# EAGLE design IsoIonV0_1 (EAGLE 6.3)
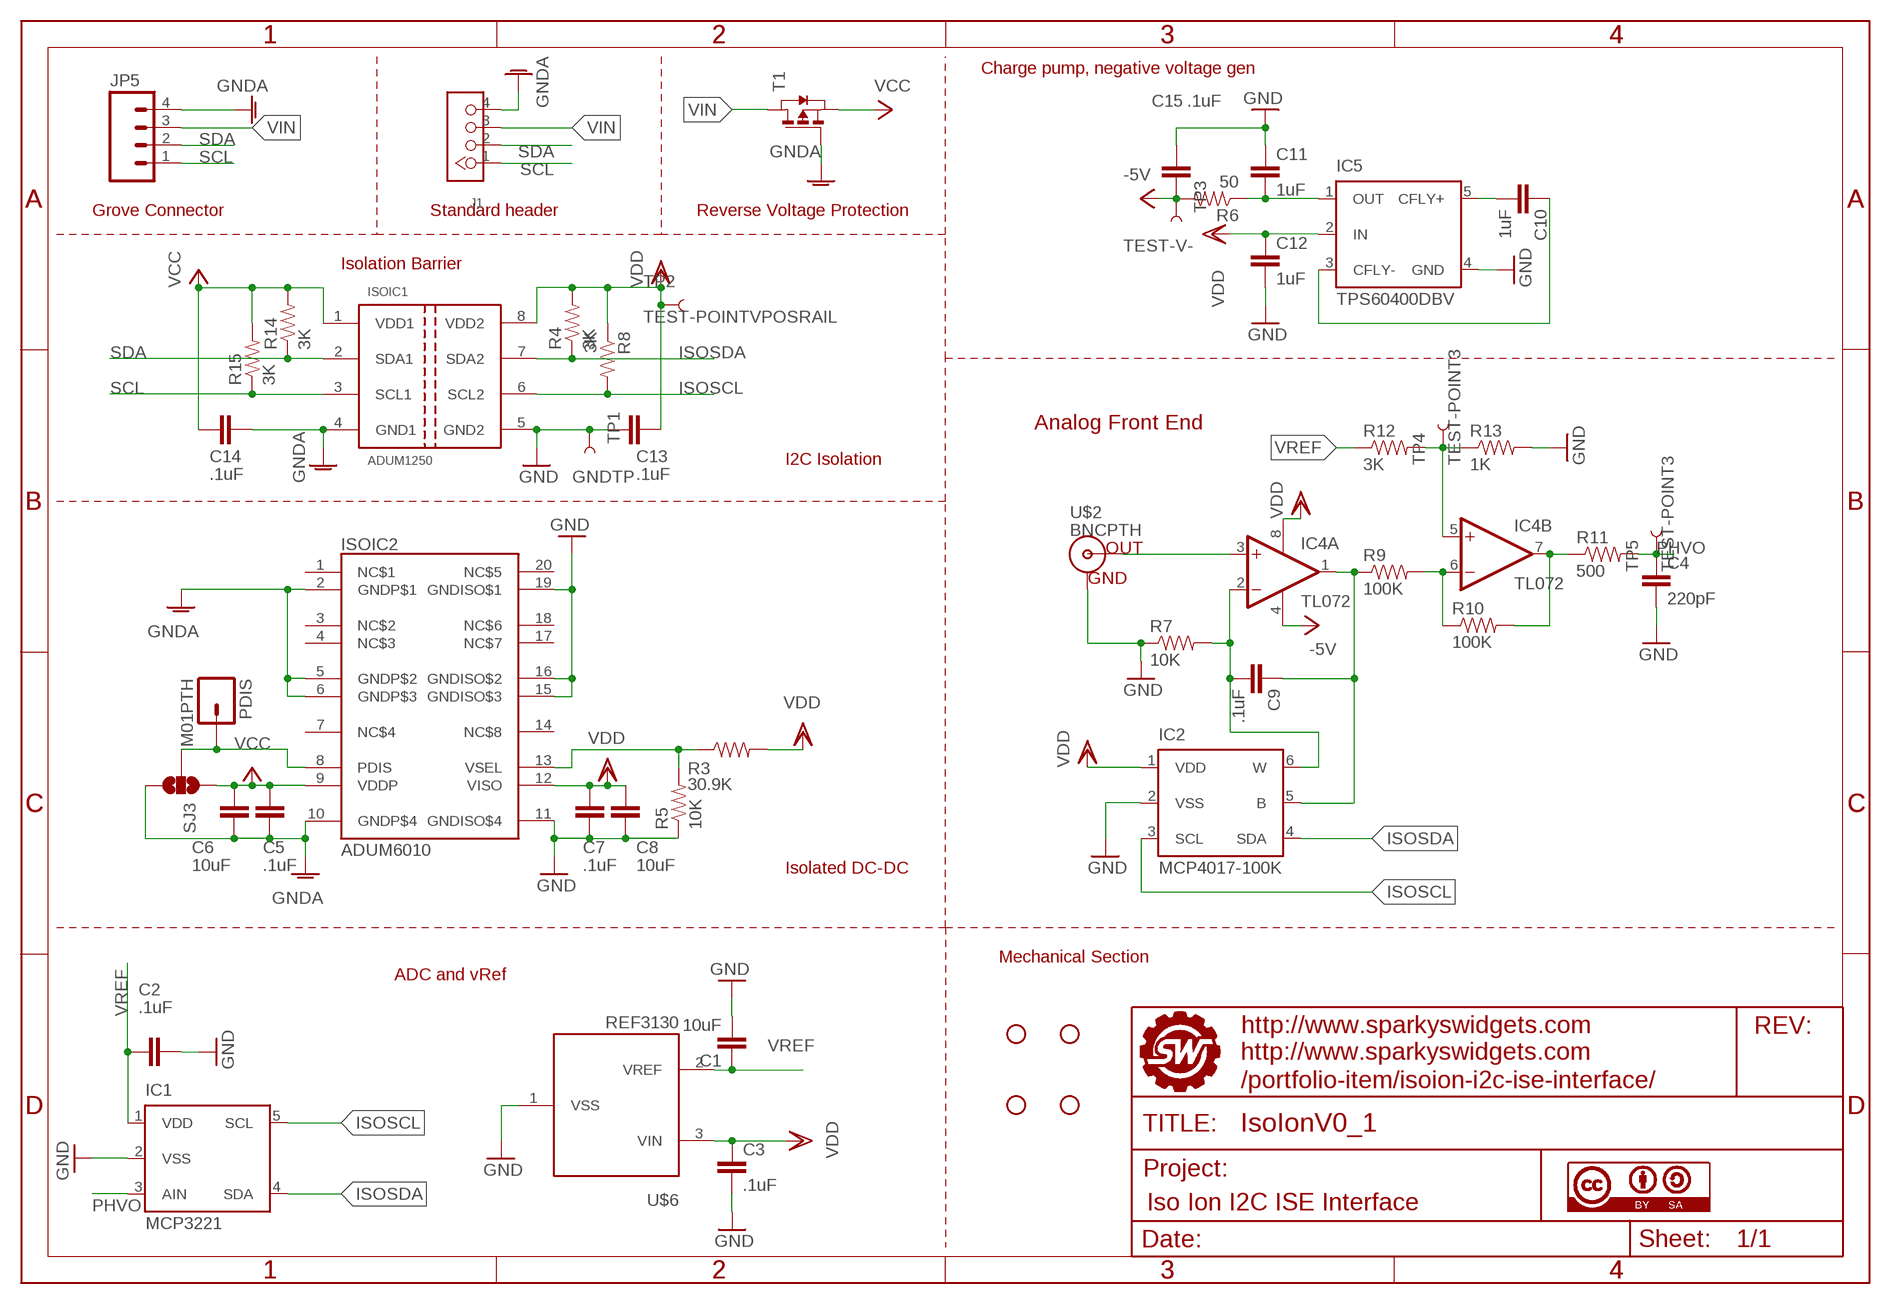
[diagram p0: schematic, sheet 1]

## Parts
C1  10uF  CAP0805  [0805]
C2  .1uF  CAP0805  [0805]
C3  .1uF  CAP0805  [0805]
C4  220pF  CAP0805  [0805]
C5  .1uF  CAP0805  [0805]
C6  10uF  CAP0805  [0805]
C7  .1uF  CAP0805  [0805]
C8  10uF  CAP0805  [0805]
C9  .1uF  CAP0805  [0805]
C10  1uF  CAP0805  [0805]
C11  1uF  CAP0805  [0805]
C12  1uF  CAP0805  [0805]
C13  .1uF  CAP0805  [0805]
C14  .1uF  CAP0805  [0805]
C15  .1uF  CAP0805  [0805]
IC1  MCP3221  [SOT23-DBV]
IC2  MCP4017-100K  MCP4017  [SC70]
IC4  TL072  LM358D  [SO08@1]
IC5  TPS60400DBV  [SOT23-DBV]
ISOIC1  ADUM1250  [SO08]
ISOIC2  ADUM6010  [SSOP20]
J1  TWIG-4P-2.0-2.0  [4P-2.0]
JP1  STAND-OFF  [STAND-OFF]
JP2  STAND-OFF  [STAND-OFF]
JP3  STAND-OFF  [STAND-OFF]
JP4  STAND-OFF  [STAND-OFF]
JP5  M04PTH  [1X04]
PDIS  M01PTH  [1X01]
R3  30.9K  RESISTOR0805-RES  [0805]
R4  3K  RESISTOR0805-RES  [0805]
R5  10K  RESISTOR0805-RES  [0805]
R6  50  RESISTOR0805-RES  [0805]
R7  10K  RESISTOR0805-RES  [0805]
R8  3K  RESISTOR0805-RES  [0805]
R9  100K  RESISTOR0805-RES  [0805]
R10  100K  RESISTOR0805-RES  [0805]
R11  500  RESISTOR0805-RES  [0805]
R12  3K  RESISTOR0805-RES  [0805]
R13  1K  RESISTOR0805-RES  [0805]
R14  3K  RESISTOR0805-RES  [0805]
R15  3K  RESISTOR0805-RES  [0805]
SJ3  SOLDERJUMPER_2WAYPASTE2&3  [SJ_3_PASTE2&3]
T1  PMOSSOT23  [SOT-23]
TP1  GNDTP  TEST-POINTGND  [TEST_GND]
TP2  TEST-POINTVPOSRAIL  [TEST_V+]
TP3  TEST-V-  TEST-POINTNEGRAIL  [TEST_V-]
TP4  TEST-POINT3  [PAD.03X.03]
TP5  TEST-POINT3  [PAD.03X.03]
U$1  FRAME_ISOION  [SWPCBLOGOWITHINFO]
U$2  BNCPTH  [BNC]
U$3  CC-BY-SA  [CC-BY-SA]
U$6  REF3130  MCP1541  [SOT-23]

## Nets
-5V: C15.2 IC4.4(P:V-) R6.2 TP3.P$1
GND: C1.2 C2.1 C3.2 C4.2 C7.2 C8.2 C11.1 C12.2 C13.1 C15.1 IC1.2(VSS) IC2.2(VSS) IC5.4(GND) ISOIC1.5(GND2) ISOIC2.11(GNDISO$4) ISOIC2.15(GNDISO$3) ISOIC2.16(GNDISO$2) ISOIC2.19(GNDISO$1) R5.1 R7.1 R13.2 TP1.P$1 U$2.GND U$6.1(VSS)
GNDA: C5.2 C6.2 C14.1 ISOIC1.4(GND1) ISOIC2.2(GNDP$1) ISOIC2.5(GNDP$2) ISOIC2.6(GNDP$3) ISOIC2.10(GNDP$4) J1.4 JP5.4 SJ3.3 T1.3(G)
ISOSCL: IC1.5(SCL) IC2.3(SCL) ISOIC1.6(SCL2) R8.2
ISOSDA: IC1.4(SDA) IC2.4(SDA) ISOIC1.7(SDA2) R4.1
N$1: IC4.5(B:+IN) R12.2 R13.1 TP4.P$1
N$2: IC4.7(B:OUT) R10.2 R11.1
N$3: IC4.6(B:-IN) R9.2 R10.1
N$4: ISOIC2.8(PDIS) PDIS.1 SJ3.2
N$5: ISOIC2.13(VSEL) R3.1 R5.2
N$6: C11.2 IC5.1(OUT) R6.1
N$7: IC4.3(A:+IN) U$2.S(OUT)
N$9: C9.2 IC2.6(W) IC4.2(A:-IN) R7.2
N$10: C9.1 IC2.5(B) IC4.1(A:OUT) R9.1
N$22: C10.1 IC5.3(CFLY-)
N$23: C10.2 IC5.5(CFLY+)
PHVO: C4.1 IC1.3(AIN) R11.2 TP5.P$1
SCL: ISOIC1.3(SCL1) J1.1 JP5.1 R15.1
SDA: ISOIC1.2(SDA1) J1.2 JP5.2 R14.1
VCC: C5.1 C6.1 C14.2 ISOIC1.1(VDD1) ISOIC2.9(VDDP) R14.2 R15.2 SJ3.1 T1.2(S)
VDD: C3.1 C7.1 C8.1 C12.1 C13.2 IC2.1(VDD) IC4.8(P:V+) IC5.2(IN) ISOIC1.8(VDD2) ISOIC2.12(VISO) R3.2 R4.2 R8.1 TP2.P$1 U$6.3(VIN)
VIN: J1.3 JP5.3 T1.1(D)
VREF: C1.1 C2.2 IC1.1(VDD) R12.1 U$6.2(VREF)
Unconnected: ISOIC2.1(NC$1) ISOIC2.3(NC$2) ISOIC2.4(NC$3) ISOIC2.7(NC$4) ISOIC2.14(NC$8) ISOIC2.17(NC$7) ISOIC2.18(NC$6) ISOIC2.20(NC$5)

## Notes on the sheet
- Charge pump, negative voltage gen
- Grove Connector | Standard header | Reverse Voltage Protection
- Isolation Barrier
- Analog Front End
- I2C Isolation
- Isolated DC-DC
- Mechanical Section
- ADC and vRef

## Library data of the parts
C1-C15 = SparkysWidgets:CAP: Capacitor Standard 0603 ceramic capacitor, and 0.1" leaded capacitor.
IC1 = SparkysWidgets:MCP3221: 12 bit I2C ADC Low power 12-bit I2c ADC from MicroChip upto 22.3KSPS Source: http://ww1.microchip.com/downloads/en/DeviceDoc/21732b.pdf
IC2 = SW_DigitalAnalogICs:MCP4017: I2C digipot 128tap digital potentiometer in 5K, 10K, 50K and 100K variants.
IC4 = SparkysWidgets:LM358: OP AMP also LM158; LM258; LM2904 Source: http://cache.national.com/ds/LM/LM158.pdf
IC5 = SparkysWidgets:TPS60400DBV: UNREGULATED CHARGE PUMP VOLTAGE INVERTER 60-mA unregultated charge pump voltage inverter Source: http://focus.ti.com/lit/ds/symlink/tps6040i.pdf
ISOIC1 = SparkysWidgets:ADUM1250: ADUM1250 Bi-Directional I2C Isolation IC AD iCoupler based tech, I2C Isolation IC, allows for Galavanically Isolated howswapable I2C devices
ISOIC2 = SparkysWidgets:ADUM6010: ADUM6010 ISO DC-DC power uModule AD iCoupler based tech, dc-dc converter. Useful for galvanically isolating supplies accepts wide inpute range and outputs regulated 3v-5.v5@150mA
J1 = Connector:TWIG-4P-2.0
JP1-JP4 = SparkFun:STAND-OFF: Stand Off This is the mechanical footprint for a #4 phillips button head screw. Use the keepout ring to avoid running the screw head into surrounding components. SKU : PRT-00447
JP5 = SparkFun:M04: Header 4 Standard 4-pin 0.1" header. Use with straight break away headers (SKU : PRT-00116), right angle break away headers (PRT-00553), swiss pins (PRT-00743), machine pins (PRT-00117), and female headers (PRT-00115). Molex polarized connector foot print use with SKU : PRT-08231 with associated crimp pins and housings. 1MM SMD Version SKU: PRT-10208
PDIS = SparkFun:M01: Header 1 Standard 1-pin 0.1" header. Use with straight break away headers (SKU : PRT-00116), right angle break away headers (PRT-00553), swiss pins (PRT-00743), machine pins (PRT-00117), and female headers (PRT-00115).
R3-R15 = SparkysWidgets:RESISTOR: Resistor Basic schematic elements and footprints for 0603, 1206, and PTH resistors.
SJ3 = SparkFun:SOLDERJUMPER_2WAY: Solder Jumper 2 way solder jumper
T1 = SparkysWidgets:PMOSSOT23: MOS FET
TP1-TP5 = SW_Passives:TEST-POINT: Bare copper test points for troubleshooting or ICT
U$1 = SW_ArtWork:FRAME_ISOION: A4 Sparky's Widgets frame This is a standard A4 Frame, the Doc Field has been modified with our Logo and contains the license and extra project information!; PROJECT: Iso Ion I2C ISE Interface; URL1: /portfolio-item/isoion-i2c-ise-interface/; URLHOME: http://www.sparkyswidgets.com; URLPROJECT: http://www.sparkyswidgets.com
U$2 = SparkysWidgets:BNC: BNC Connector, Mouser Part# 5227161
U$3 = SW_ArtWork:CC-BY-SA
U$6 = SparkysWidgets:MCP1541

## Board
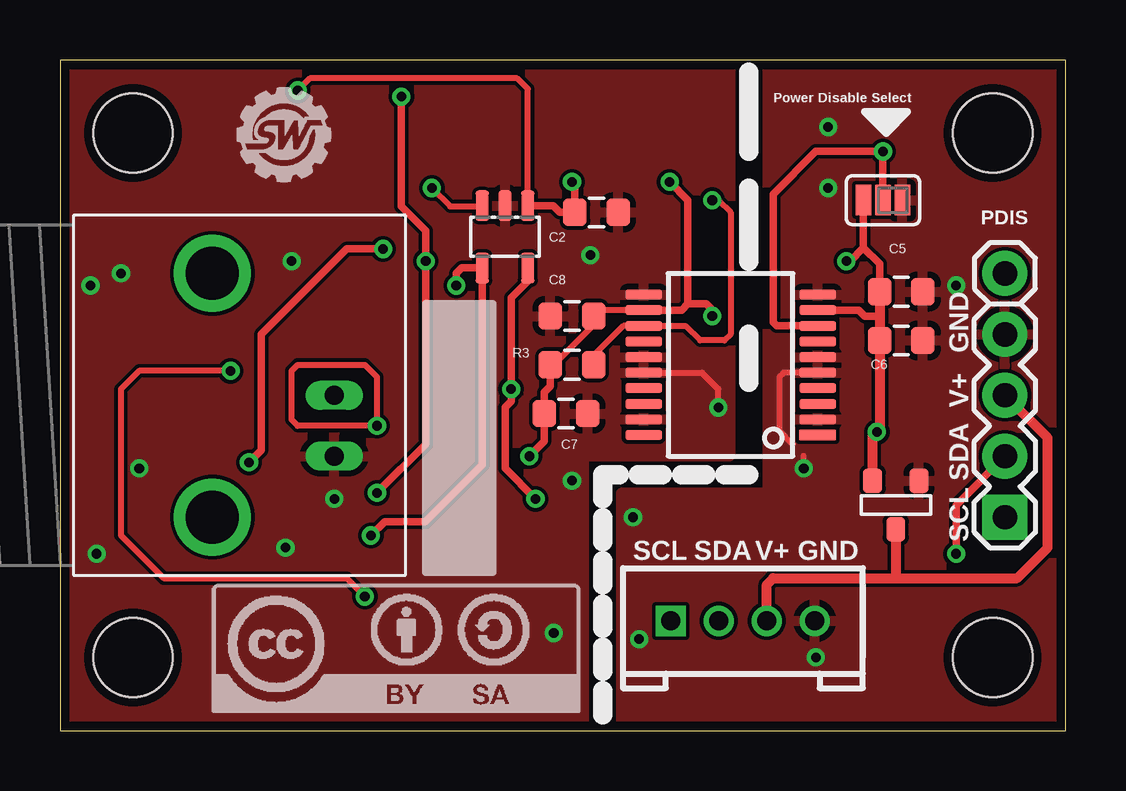
[diagram p1: board, top side]
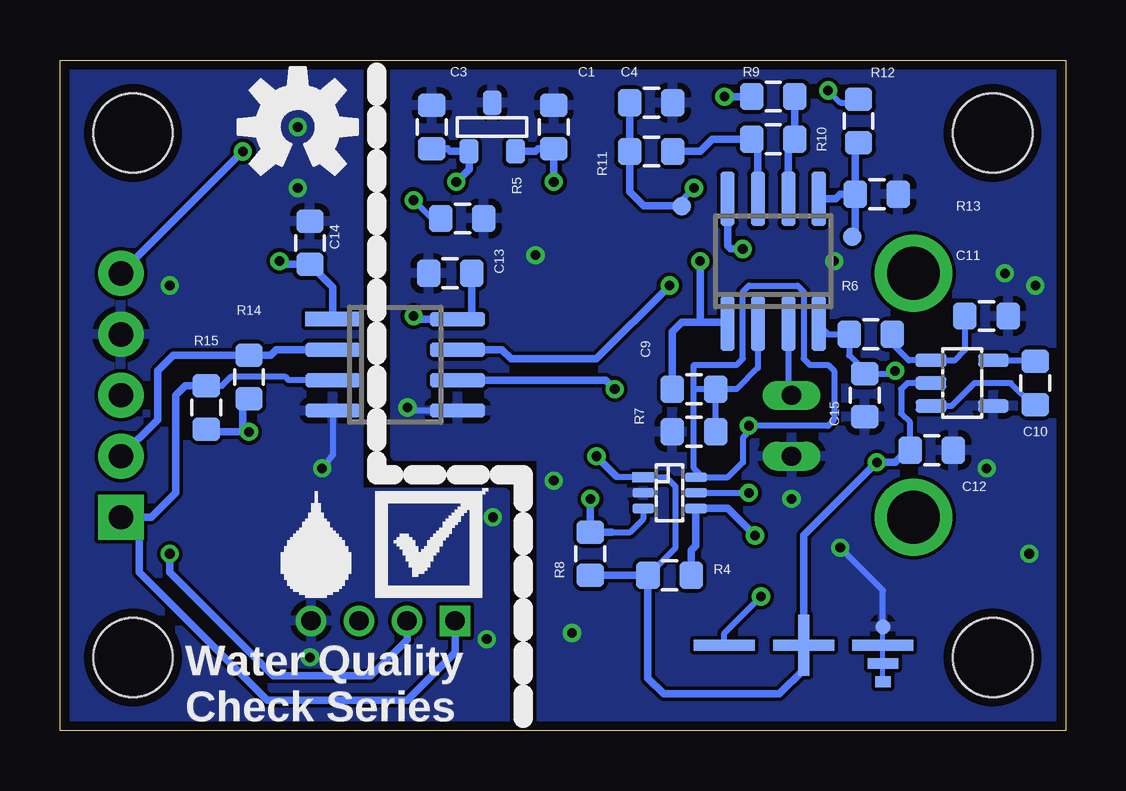
[diagram p2: board, bottom side, seen from below]

Size 41.91 x 27.94 mm. Coordinates in mm from the lower left corner, seen from the top.
Outline: 0,0 41.91,0 41.91,27.94 0,27.94 0,0
Copper layers (1*16): Top 0.0356mm / dielectric 1.5011mm / Bottom 0.0356mm
Design rules "LaenPCBOrder": minimum track width 6mil, minimum drill 13mil, track to track 6mil, track to pad 6mil, pad to pad 6mil, via to via 6mil, smd to smd 6mil, copper to edge 15mil, drill to drill 6mil, minimum pad ring 7mil, minimum via ring 7mil, stop-mask expansion 4mil, vias tented up to drill 0mil, thermal gap 10mil

### Footprints (pad centres in the part's own frame; a part is rotated, then mirrored left to right if it is on the bottom)
0805 = smd 0.984 x 1.143: 1 -0.9,0; 2 0.9,0
SOT23-DBV = smd 0.55 x 1.27: 1 -0.95,-1.3; 2 0,-1.3; 3 0.95,-1.3; 4 0.95,1.3; 5 -0.95,1.3
SC70 = smd 0.4 x 0.9: 1 -0.65,-1.1; 2 0,-1.1; 3 0.65,-1.1; 4 0.65,1.1; 5 0,1.1; 6 -0.65,1.1
SO08@1 = smd 0.6 x 2.286: 1 -1.905,-2.6; 2 -0.635,-2.6; 3 0.635,-2.6; 4 1.905,-2.6; 5 1.905,2.6; 6 0.635,2.6; 7 -0.635,2.6; 8 -1.905,2.6
SO08 = smd 0.6 x 2.286: 1 -1.905,-2.6; 2 -0.635,-2.6; 3 0.635,-2.6; 4 1.905,-2.6; 5 1.905,2.6; 6 0.635,2.6; 7 -0.635,2.6; 8 -1.905,2.6
SSOP20 = smd 0.419 x 1.524: 1 -2.925,-3.625; 2 -2.275,-3.625; 3 -1.625,-3.625; 4 -0.975,-3.625; 5 -0.325,-3.625; 6 0.325,-3.625; 7 0.975,-3.625; 8 1.625,-3.625; 9 2.275,-3.625; 10 2.925,-3.625; 11 2.925,3.625; 12 2.275,3.625; 13 1.625,3.625; 14 0.975,3.625; 15 0.325,3.625; 16 -0.325,3.625; 17 -0.975,3.625; 18 -1.625,3.625; 19 -2.275,3.625; 20 -2.925,3.625
4P-2.0 = drill 0.8 pad 1.27 square: 1 -3,0 | drill 0.8 pad 1.27: 2 -1,0; 3 1,0; 4 3,0
STAND-OFF = hole 3.302: 0,0
1X04 = drill 1.016 pad 1.88 square: 1 0,0 | drill 1.016 pad 1.88: 2 2.54,0; 3 5.08,0; 4 7.62,0
1X01 = drill 1.016 pad 1.88: 1 0,0
SJ_3_PASTE2&3 = smd 0.635 x 1.27: 1 -0.813,0; 2 0,0; 3 0.813,0
SOT-23 = smd 0.787 x 1.016: 1 0.025,-1.016; 2 -0.94,1.016; 3 0.991,1.016
TEST_GND = smd 0.635 x 0.635: P$1 0,0.762 | smd 2.54 x 0.457: P$2 0,0 | smd 1.27 x 0.457: P$3 0,-0.762 | smd 0.635 x 0.457: P$4 0,-1.524
TEST_V+ = smd 0.457 x 1.27: P$1 0,0.635; P$2 0,-0.635 | smd 2.54 x 0.457: P$3 0,0
TEST_V- = smd 2.54 x 0.457: P$1 0,0
PAD.03X.03 = smd 0.762 x 0.762: P$1 0,0
BNC = drill 2.2: 3 -5.08,5.08; 4 5.08,5.08 | drill 0.8 long: GND -2.54,0; S 0,0

### Placement (x,y rotation side)
C1  21.34,25.15 90 bottom
C2  22.35,21.59 180 top
C3  26.42,25.15 90 bottom
C4  17.27,26.16 0 bottom
C5  35.05,18.29 0 top
C6  35.05,16.26 0 top
C7  21.08,13.21 0 top
C8  21.34,17.27 180 top
C9  15.49,14.22 0 bottom
C10  1.27,14.48 90 bottom
C11  3.3,17.27 180 bottom
C12  5.59,11.68 0 bottom
C13  25.65,19.05 0 bottom
C14  31.5,20.32 270 bottom
C15  8.38,13.97 90 bottom
IC1  18.54,20.57 180 top
IC2  16.51,9.91 270 bottom
IC4  12.19,19.56 0 bottom
IC5  4.32,14.48 270 bottom
ISOIC1  27.94,15.24 270 bottom
ISOIC2  27.94,15.24 90 top
J1  28.45,4.57 0 top
JP1  38.86,3.05 0 top
JP2  3.05,3.05 0 top
JP3  38.86,24.89 0 top
JP4  3.05,24.89 0 top
JP5  39.37,8.89 90 top
PDIS  39.37,19.05 0 top
R3  21.34,15.24 180 top
R4  16.51,6.48 180 bottom
R5  25.15,21.34 180 bottom
R6  8.13,16.51 180 bottom
R7  15.49,12.45 0 bottom
R8  19.81,7.37 90 bottom
R9  12.19,26.42 0 bottom
R10  12.19,24.64 180 bottom
R11  17.27,24.13 180 bottom
R12  8.64,25.4 270 bottom
R13  7.87,22.35 0 bottom
R14  34.04,14.73 270 bottom
R15  35.81,13.46 270 bottom
SJ3  34.29,22.1 0 top
T1  34.8,9.4 0 top
TP1  7.62,3.56 0 bottom
TP2  10.92,3.56 0 bottom
TP3  14.22,3.56 0 bottom
TP4  8.89,20.57 0 bottom
TP5  16,21.84 0 bottom
U$1  7.37,22.86 0 top
U$2  11.43,13.97 90 top
U$3  6.35,0.76 0 top
U$4  [OSHW-LOGO-M]  32,25.15 0 bottom
U$6  23.88,25.15 180 bottom
U$7  [SILK_ARROW]  34.29,25.15 0 top
U$8  [WATERCHECKLOGO2]  29.21,7.62 0 bottom
U$9  [WATERCHECKLOGO3]  30.99,2.54 0 bottom

### Tracks (layer width: path | path; a pad name or v marks a point on that pad's centre or on a via)
-5V  (via drill 0.4)
  Top 0.254: v7.11,14.99 3.3,14.99 2.54,14.22 2.54,8.13 4.32,6.35 11.94,6.35 v12.7,5.59
  Bottom 0.254: IC4.4 10.29,16.89 9.91,16.51 R6.2 9.03,15.63 8.27,14.87 C15.2 7.23,14.87 v7.11,14.99 | v12.7,5.59 14.22,4.06 TP3.P$1
GND  (via drill 0.4)
  Top 0.254: v27.43,13.46 27.43,14.22 26.74,14.91 ISOIC2.16
  Bottom 0.254: ISOIC1.5 27.3,13.34 v27.43,13.46 | TP1.P$1 7.62,5.84 v9.4,7.62
  other vias: 22.1,19.81 20.57,4.06 2.54,19.05 21.34,10.41 1.27,18.54 3.3,10.92 11.43,9.65 9.65,19.56 1.52,7.37
  pour Bottom: 21.84,-0.51 21.84,11.43 27.94,11.43 27.94,28.45 -0.51,28.45 -0.51,-0.51
  pour Top: -0.51,28.45 -0.51,-0.51 21.84,-0.51 21.84,11.43 27.94,11.43 27.94,28.45
GNDA  (via drill 0.4)
  Top 0.254: v30.99,10.92 30.99,11.43 | 31.5,12.9 ISOIC2.2 | ISOIC2.5 30.16,14.91 29.97,14.73 29.97,12.51 30.54,11.94
  Bottom 0.254: ISOIC1.4 30.54,11.49 v30.99,10.92
  other vias: 32,22.61 32,25.15 23.88,8.89 37.34,18.54 24.13,3.81 31.5,3.05
  pour Top: 23.37,-0.51 42.42,-0.51 42.42,28.45 29.46,28.45 29.46,9.91 23.37,9.91
  pour Bottom: 23.37,-0.51 23.37,9.91 29.46,9.91 29.46,28.45 42.42,28.45 42.42,-0.51
ISOSCL  (via drill 0.4)
  Top 0.305: IC1.5 19.49,18.73 18.8,18.03 v18.8,14.22 18.8,13.72 18.54,13.46 18.54,10.92 v19.81,9.65
  Bottom 0.254: IC2.3 17.61,8.81 18.15,8.27 18.91,8.27
  Bottom 0.305: 18.91,8.27 R8.2 v19.81,9.65 | ISOIC1.6 19.18,14.61 v18.8,14.22
ISOSDA  (via drill 0.4)
  Top 0.305: v12.95,8.13 13.53,8.7 15.21,8.7 17.59,11.08 IC1.4 16.73,19.27 16.51,19.05 v16.51,18.54
  Bottom 0.305: R4.1 15.61,7.5 15.41,7.7 IC2.4 14.08,9.26 v12.95,8.13 | ISOIC1.7 23.5,15.88 23.11,15.49 19.56,15.49 v16.51,18.54
N$1
  Bottom 0.305: R13.1 8.77,24.36 R12.2 | IC4.5 9.59,22.16 9.4,22.35 R13.1 | R13.1 8.77,20.69 TP4.P$1
N$2
  Bottom 0.305: IC4.7 12.83,24.37 R10.2 14.73,24.64 15.24,24.13 R11.1
N$3
  Bottom 0.305: IC4.6 11.56,24.37 R10.1 R9.2
N$4  (via drill 0.4)
  Top 0.305: SJ3.2 v34.29,24.13 31.5,24.13 29.72,22.35 29.72,17.02 29.87,16.86 ISOIC2.8
  Bottom 0.305: PDIS.1 v34.29,24.13
N$5  (via drill 0.4)
  Top 0.254: v27.18,22.1 27.43,22.1 27.94,21.59 27.94,16.51 27.69,16.26 26.67,16.26 26.06,16.86 ISOIC2.13 23.47,16.86 22.24,15.63 R3.1
  Bottom 0.254: 26.3,21.22 v27.18,22.1
  Bottom 0.305: R5.2 26.3,21.22
N$6
  Bottom 0.254: C11.2 4.2,15.86 4.64,15.43 IC5.1 6.54,15.43 7.23,16.12 R6.1
N$7
  Bottom 0.254: IC4.3 11.56,14.1 U$2.S
N$9  (via drill 0.4)
  Top 0.254: v13.21,12.7 9.91,12.7 9.65,12.95 9.65,14.99 9.91,15.24 12.7,15.24 13.21,14.73 v13.21,12.7
  Bottom 0.254: IC4.2 12.83,15.11 13.72,14.22 C9.2 | C9.2 15.49,14.22 | 15.49,14.22 15.49,15.24 13.72,15.24 13.46,15.49 13.46,18.29 13.21,18.54 11.18,18.54 10.92,18.29 10.92,15.49 10.67,15.24 9.91,15.24 9.65,14.99 9.65,12.95 9.91,12.7 12.95,12.7 13.08,12.57 | 13.08,12.57 13.46,12.19 13.46,11.18 14.08,10.56 IC2.6 15.21,10.64 15.49,10.92 15.49,14.22 | 14.59,12.08 R7.2 C9.2 | v13.21,12.7 13.08,12.57
N$10  (via drill 0.4)
  Top 0.305: v14.22,26.42 14.22,21.84 15.24,20.83 v15.24,19.56 15.24,11.94 v13.21,9.91
  Bottom 0.254: IC2.5 v13.21,9.91
  Bottom 0.305: R9.1 v14.22,26.42 | C9.1 16.39,16.63 16,17.02 15.24,17.02 | 15.24,17.02 v15.24,19.56 | 15.24,17.02 14.16,17.02 IC4.1
N$22
  Bottom 0.254: C10.1 1.39,13.58 2.29,14.48 3.81,14.48 4.76,13.53 IC5.3
N$23
  Bottom 0.254: IC5.5 1.27,15.43 C10.2
PHVO  (via drill 0.4)
  Top 0.254: v15.49,22.61 16.26,21.84 17.56,21.84 IC1.3
  Bottom 0.254: 16.03,21.87 16.03,22.07 v15.49,22.61
  Bottom 0.305: C4.1 R11.2 18.17,22.45 IC1.3 16.03,21.87 TP5.P$1
SCL
  Bottom 0.254: ISOIC1.3 32.38,14.61 32.51,14.73 34.8,14.73 35.17,14.36 R15.1
  Bottom 0.305: JP5.1 38.61,8.89 | 38.61,8.89 38.1,8.89 37.08,9.91 37.08,13.97 36.69,14.36 R15.1 | J1.1 25.45,3.25 27.43,1.27 33.27,1.27 38.61,6.6 38.61,8.89
SDA  (via drill 0.4)
  Top 0.305: v37.34,7.37 37.34,9.4 JP5.2
  Bottom 0.305: JP5.2 37.85,12.95 37.85,14.99 37.2,15.63 R14.1 33.14,15.63 32.89,15.88 ISOIC1.2 | J1.2 27.45,3.79 28.96,2.29 33.02,2.29 37.34,6.6 v37.34,7.37
VCC  (via drill 0.4)
  Top 0.305: ISOIC2.9 33.28,17.52 33.53,17.27 34.15,17.27 | SJ3.1 33.48,20.12 | 33.48,20.12 34.15,19.44 C5.1 | v32.77,19.56 32.92,19.56 33.48,20.12
  Top 0.406: C5.1 34.15,17.27 C6.1 34.15,12.33 v34.04,12.45 33.86,12.27 T1.2
  Bottom 0.305: v32.77,19.56 32.63,19.42 C14.2 30.54,18.46 ISOIC1.1 | v34.04,12.45 34.29,12.45 | 34.29,12.45 35.7,12.45 R15.2 | 34.29,12.45 34.29,13.58 R14.2
VDD  (via drill 0.4)
  Top 0.254: ISOIC2.12 22.48,17.52 C8.1 22.1,17.13 22.1,16.76 20.57,15.24 R3.2
  Top 0.305: v7.87,11.18 8.38,11.68 8.38,16.51 11.94,20.07 v13.46,20.07 | v25.4,22.86 26.16,22.1 26.16,17.78 | ISOIC2.12 25.9,17.52 26.16,17.78 | v27.18,17.27 27.18,17.53 26.92,17.78 26.16,17.78 | R3.2 20.44,14.34 20.18,14.09 C7.1 20.18,12.05 v19.56,11.43
  Bottom 0.254: IC5.2 6.6,14.48 6.86,14.22 6.86,13.21 6.49,12.84 C12.1 | R4.2 16.26,7.62 16.26,10.16 16.65,10.56 IC2.1 18.68,10.56 18.73,10.6
  Bottom 0.305: C3.1 25.77,24.25 25.65,24.13 U$6.3 24.87,23.39 v25.4,22.86 | v13.46,20.07 13.97,20.07 14.1,20.19 IC4.8 | C12.1 6.6,11.68 7.11,11.18 v7.87,11.18 10.92,8.13 TP2.P$1 10.92,2.54 11.94,1.52 16.76,1.52 17.41,2.17 R4.2 17.42,6.47 R8.1 | v27.18,17.27 27.05,17.14 ISOIC1.8 25.21,17.02 24.89,17.02 24.75,17.16 C13.2 | 18.73,10.6 v19.56,11.43
VIN
  Top 0.406: J1.3 29.45,6.08 29.72,6.35 34.8,6.35 | 34.8,6.35 39.88,6.35 41.15,7.62 41.15,12.19 JP5.3 | T1.1 34.82,6.38 34.8,6.35
VREF  (via drill 0.4)
  Top 0.254: IC1.1 19.49,26.74 19.05,27.18 10.41,27.18 v9.91,26.67
  Top 0.305: IC1.1 20.54,21.87 20.83,21.59 C2.2 21.45,22.74 v21.34,22.86
  Bottom 0.254: v9.91,26.67 9.4,26.16 8.77,26.16 R12.1
  Bottom 0.305: v21.34,22.86 C1.1 21.98,24.25 22.1,24.13 U$6.2

### Text on the board
tPlace: Power Disable Select | PDIS | GND | V+ | SDA | SCL | SCL | SDA | V+ | GND